# Altium schematic sheet InputLevelShifter.SchDoc
size A4
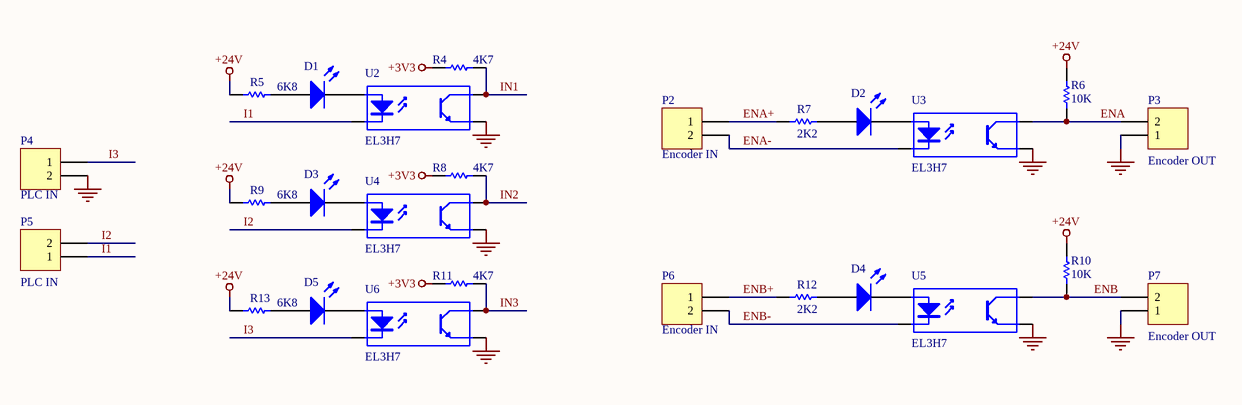
[diagram p0: InputLevelShifter.SchDoc]

## Parts
D1  SMD0805-RED  [LED-0805]  (value not drawn)
D2  SMD0805-RED  [LED-0805]  (value not drawn)
D3  SMD0805-RED  [LED-0805]  (value not drawn)
D4  SMD0805-RED  [LED-0805]  (value not drawn)
D5  SMD0805-RED  [LED-0805]  (value not drawn)
P2  value Encoder IN  [TER-KF128-2P]  (hidden comment: KF128-2P)
P3  value Encoder OUT  [TER-KF128-2P]  (hidden comment: KF128-2P)
P4  value PLC IN  [TER-KF128-2P]  (hidden comment: KF128-2P)
P5  value PLC IN  [TER-KF128-2P]  (hidden comment: KF128-2P)
P6  value Encoder IN  [TER-KF128-2P]  (hidden comment: KF128-2P)
P7  value Encoder OUT  [TER-KF128-2P]  (hidden comment: KF128-2P)
R4  4K7  [R-0805]
R5  6K8  [R-0805]
R6  10K  [R-0805]
R7  2K2  [R-0805]
R8  4K7  [R-0805]
R9  6K8  [R-0805]
R10  10K  [R-0805]
R11  4K7  [R-0805]
R12  2K2  [R-0805]
R13  6K8  [R-0805]
U2  EL3H7  [SSOP-4]
U3  EL3H7  [SSOP-4]
U4  EL3H7  [SSOP-4]
U5  EL3H7  [SSOP-4]
U6  EL3H7  [SSOP-4]

## Nets
+3V3: R4.2 R8.2 R11.2
+24V: R5.1 R6.2 R9.1 R10.2 R13.1
GND: P3.1 P4.2 P7.1 U2.3(E) U3.3(E) U4.3(E) U5.3(E) U6.3(E)
ENA: P3.2 R6.1 U3.4(C)
ENA+: P2.1 R7.1
ENA-: P2.2 U3.2(K)
ENB: P7.2 R10.1 U5.4(C)
ENB+: P6.1 R12.1
ENB-: P6.2 U5.2(K)
I1: P5.1 U2.2(K)
I2: P5.2 U4.2(K)
I3: P4.1 U6.2(K)
IN1: R4.1 U2.4(C)
IN2: R8.1 U4.4(C)
IN3: R11.1 U6.4(C)
NetD1_1: D1.1(A) R5.2
NetD1_2: D1.2(K) U2.1(A)
NetD2_1: D2.1(A) R7.2
NetD2_2: D2.2(K) U3.1(A)
NetD3_1: D3.1(A) R9.2
NetD3_2: D3.2(K) U4.1(A)
NetD4_1: D4.1(A) R12.2
NetD4_2: D4.2(K) U5.1(A)
NetD5_1: D5.1(A) R13.2
NetD5_2: D5.2(K) U6.1(A)

## Library data of the parts
D1-D5 = LED0: Typical INFRARED GaAs LED; Value: StatusLed; Published: 8-Jun-2000; LatestRevisionDate: 08-Jul-2005; LatestRevisionNote: Mech Layer 1 removed.; PackageReference: LED-0
P2-P7 = Header 2: Header, 2-Pin; LatestRevisionDate: 17-Jul-2002; LatestRevisionNote: Re-released for DXP Platform.
R4-R13 = Res1: Resistor; Published: 8-Jun-2000; LatestRevisionDate: 17-Jul-2002; LatestRevisionNote: Re-released for DXP Platform.; PackageReference: AXIAL-0.3; Publisher: Altium Limited; PackageDescription: Axial Device, Thru-Hole; 2 Leads; 0.3 in Pin Spacing
  R4 R8 R11: Value: 4K7
  R5 R9 R13: Value: 6K8
  R6 R10: Value: 10K
  R7 R12: Value: 2K2
U2-U6 = Optoisolator1: 4-Pin Phototransistor Optocoupler; Published: 24-Mar-1999; LatestRevisionDate: 04-Mar-2005; LatestRevisionNote: Sch pins 3 & 4 Swapped.; DatasheetDocument: Nov-2003; PackageReference: DIP-4; Value: EL3H7